# EAGLE design baby_monitor_v0 (EAGLE 9.6.2)

## Sheet 1 of 3: Power
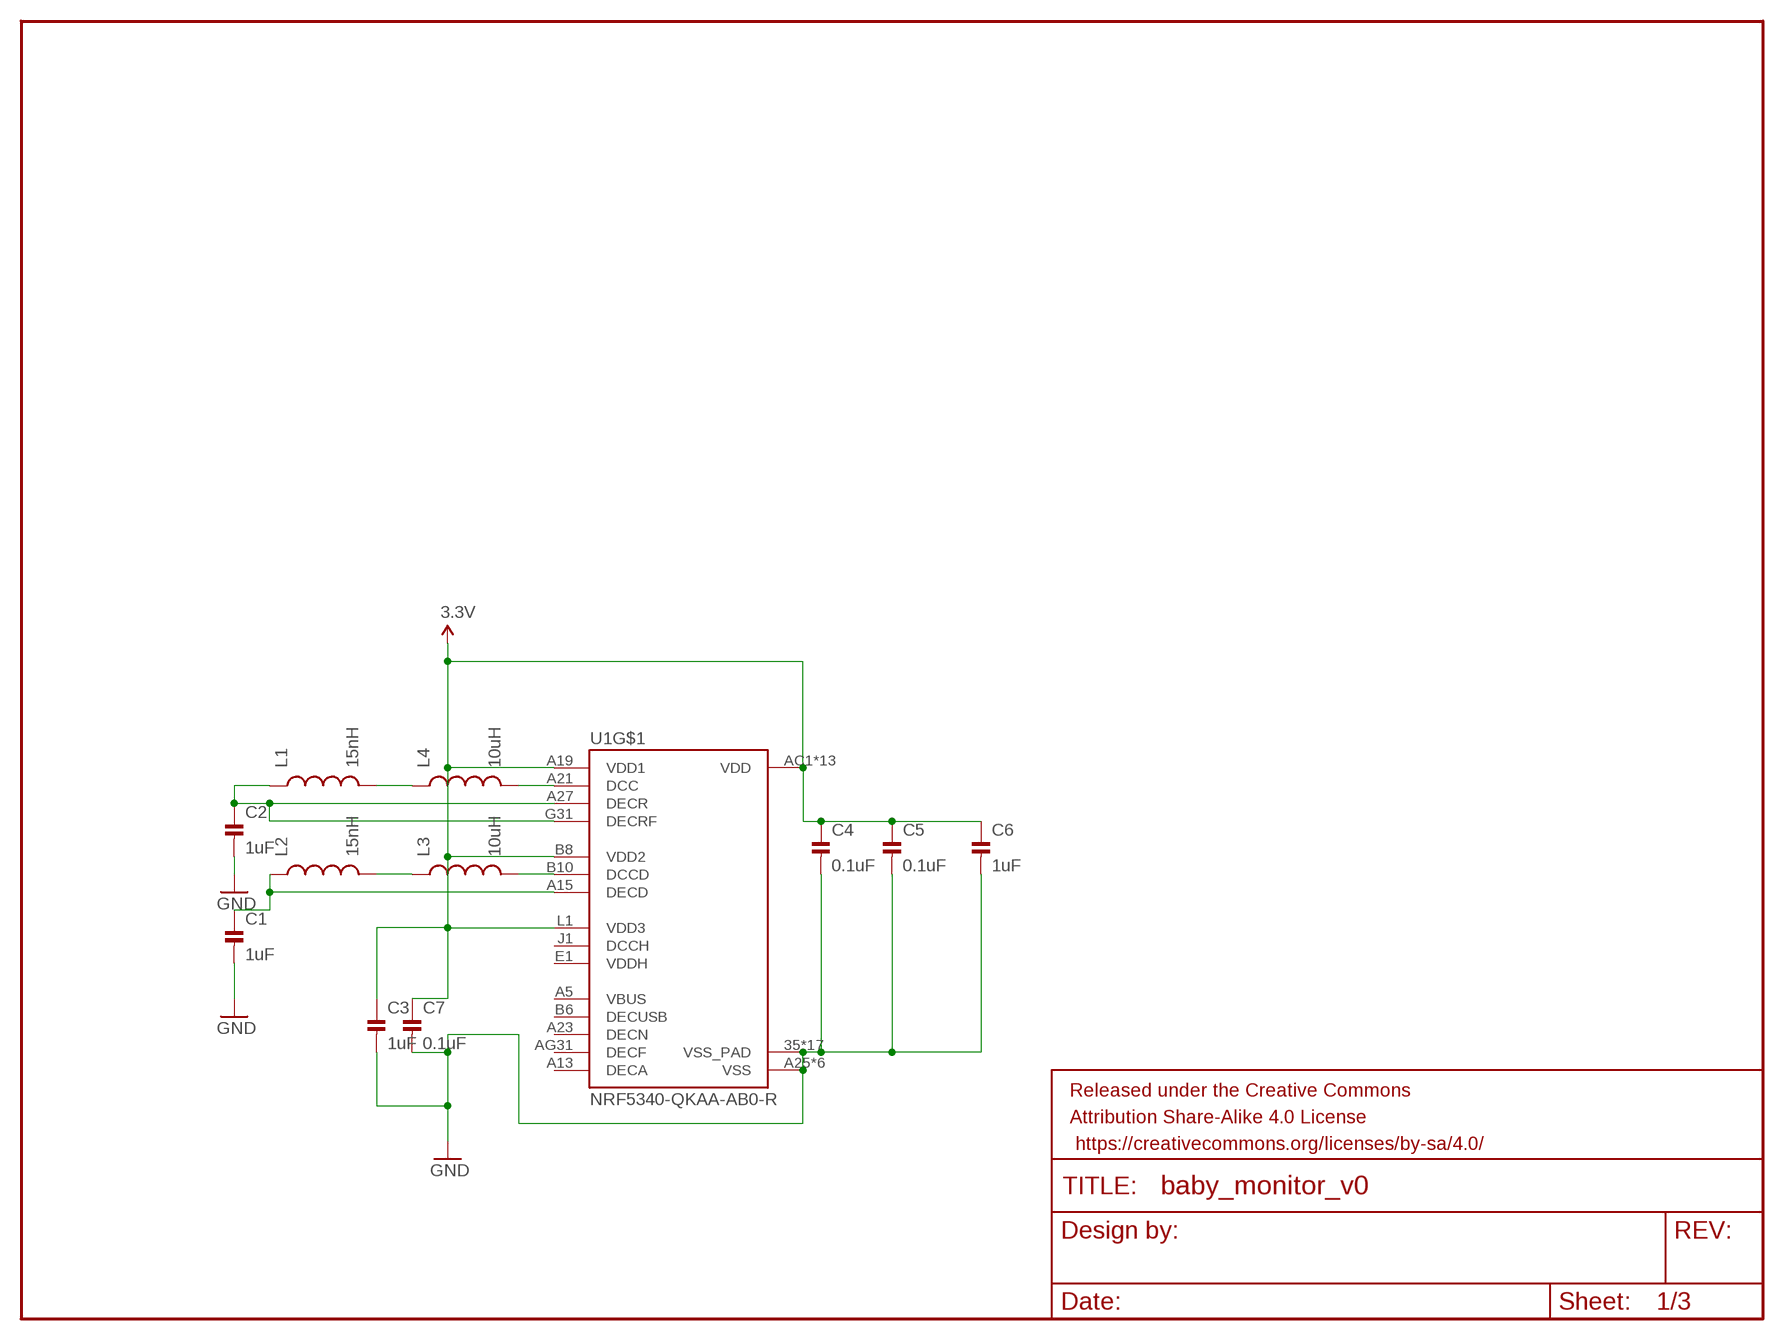
[diagram p0: schematic, sheet 1]

### Parts
C1  1uF  MICROBUILDER_CAP_CERAMIC_0402MP  [MICROBUILDER__0402MP]
C2  1uF  MICROBUILDER_CAP_CERAMIC_0402MP  [MICROBUILDER__0402MP]
C3  1uF  MICROBUILDER_CAP_CERAMIC_0402MP  [MICROBUILDER__0402MP]
C4  0.1uF  MICROBUILDER_CAP_CERAMIC_0402MP  [MICROBUILDER__0402MP]
C5  0.1uF  MICROBUILDER_CAP_CERAMIC_0402MP  [MICROBUILDER__0402MP]
C6  1uF  MICROBUILDER_CAP_CERAMIC_0402MP  [MICROBUILDER__0402MP]
C7  0.1uF  MICROBUILDER_CAP_CERAMIC_0402MP  [MICROBUILDER__0402MP]
FRAME1  FRAME-LETTERNO_PACKAGE  [DUMMY]
L1  15nH  NORDIC_MISC_INDUCTOR_0402_N  [NORDIC_MISC_RESC0402_N]
L2  15nH  NORDIC_MISC_INDUCTOR_0402_N  [NORDIC_MISC_RESC0402_N]
L3  10uH  NORDIC_MISC_INDUCTOR_0603_N  [NORDIC_MISC_RESC0603_N]
L4  10uH  NORDIC_MISC_INDUCTOR_0603_N  [NORDIC_MISC_RESC0603_N]
U1  NRF5340-QKAA-AB0-R  [XCVR_NRF5340-QKAA-AB0-R]

### Nets
3.3V: C3.1 C4.1 C5.1 C6.1 C7.1 U1.A19(VDD1) U1.AC1(VDD) U1.AG1(VDD) U1.AJ31(VDD) U1.AL3(VDD) U1.AL7(VDD) U1.AL11(VDD) U1.AL17(VDD) U1.AL25(VDD) U1.B8(VDD2) U1.B28(VDD) U1.C1(VDD) U1.E31(VDD) U1.L1(VDD3) U1.N31(VDD) U1.U1(VDD) ; also sheet 2,3
GND: C1.2 C2.2 C3.2 C4.2 C5.2 C6.2 C7.2 U1.35(VSS_PAD) U1.36(VSS_PAD) U1.37(VSS_PAD) U1.38(VSS_PAD) U1.39(VSS_PAD) U1.40(VSS_PAD) U1.41(VSS_PAD) U1.43(VSS_PAD) U1.44(VSS_PAD) U1.45(VSS_PAD) U1.46(VSS_PAD) U1.47(VSS_PAD) U1.48(VSS_PAD) U1.49(VSS_PAD) U1.50(VSS_PAD) U1.51(VSS_PAD) U1.104(VSS_PAD) U1.A25(VSS) U1.B12(VSS) U1.B26(VSS) U1.G1(VSS) U1.H2(VSS) U1.J31(VSS) ; also sheet 2,3
N$4: L4.2 U1.A21(DCC)
N$5: L1.2 L4.1
N$6: L2.2 L3.1
N$7: L3.2 U1.B10(DCCD)
N$8: C2.1 L1.1 U1.A27(DECR) U1.G31(DECRF)
N$9: C1.1 L2.1 U1.A15(DECD)

## Sheet 2 of 3: Antenna
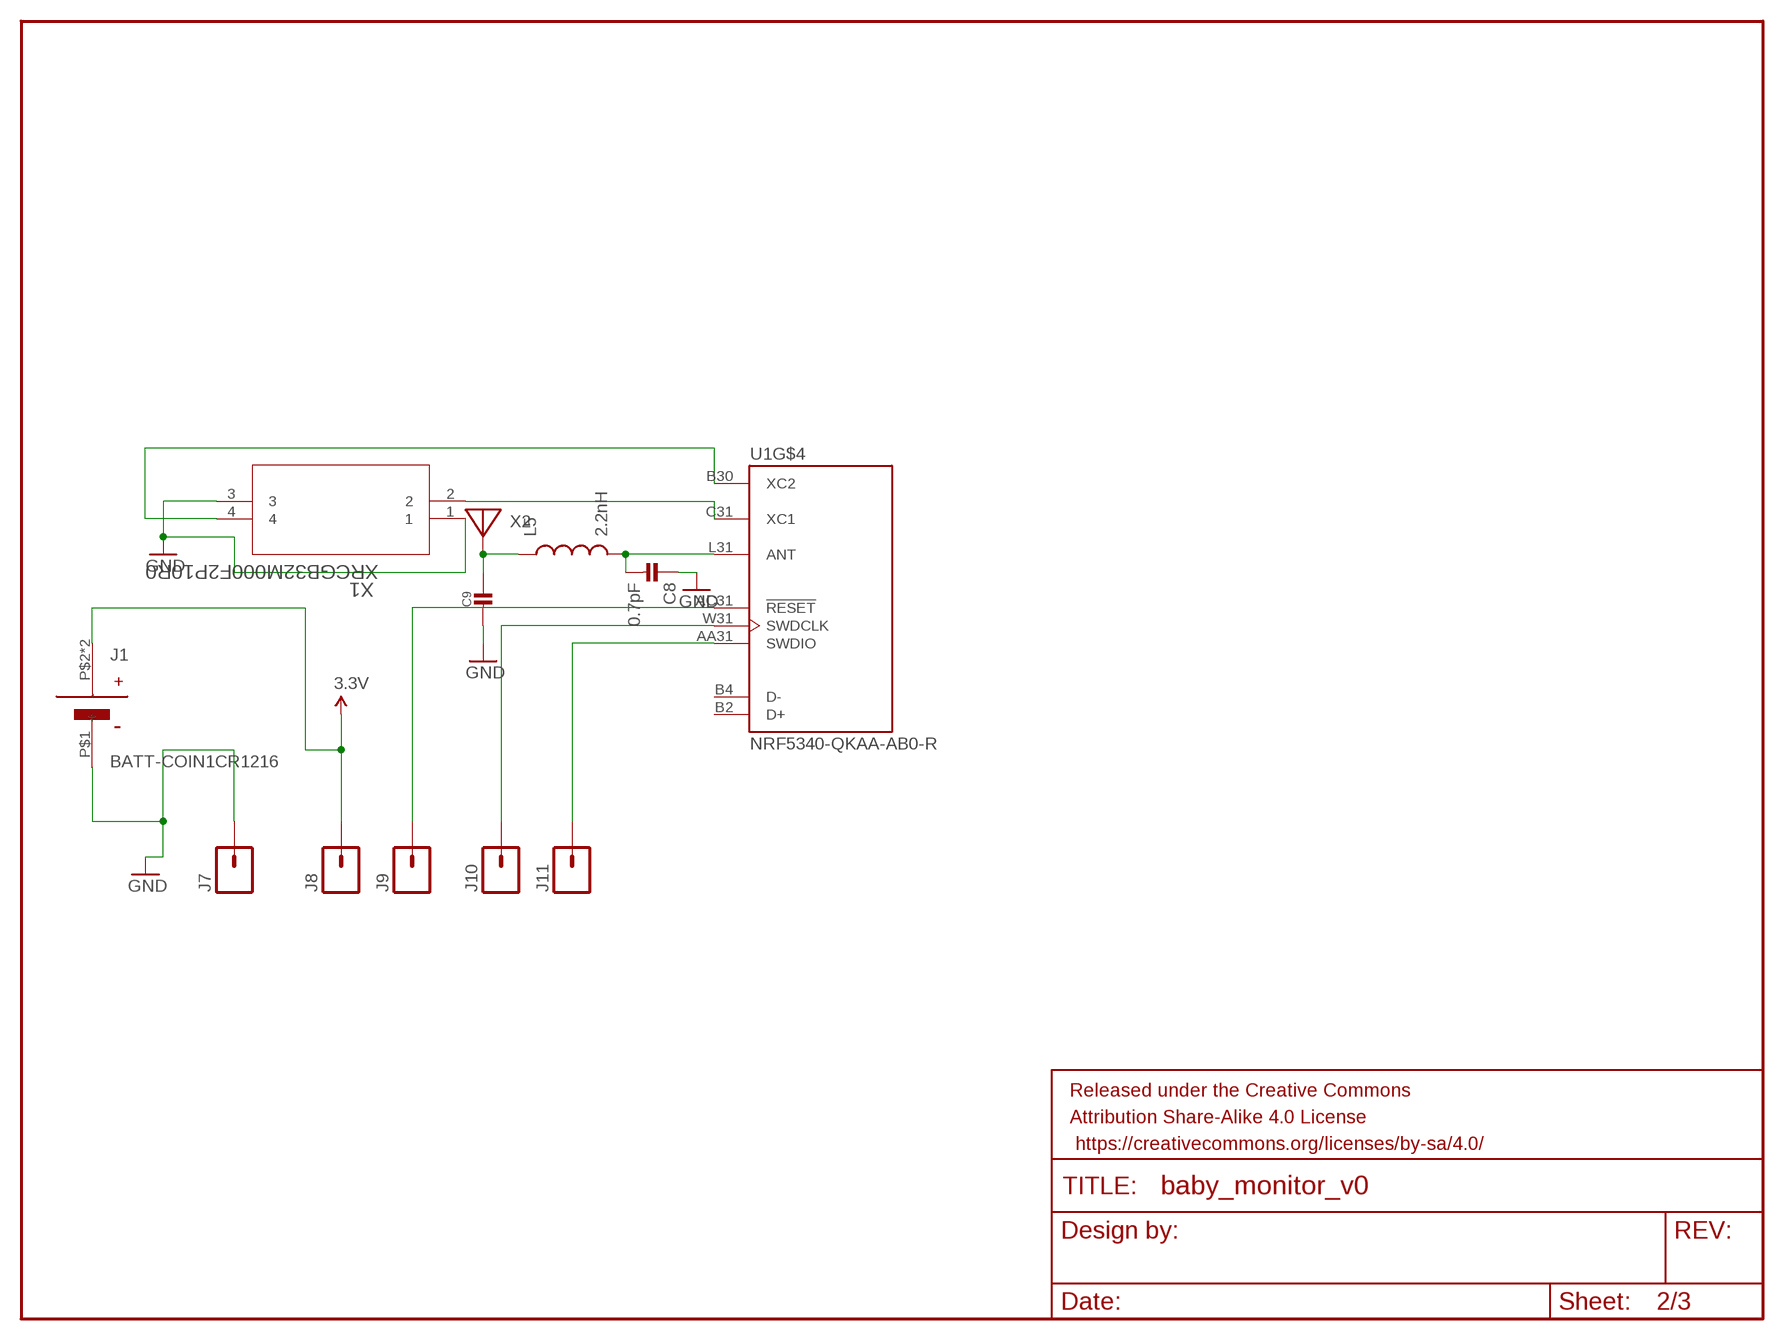
[diagram p1: schematic, sheet 2]

### Parts
C8  0.7pF  MICROBUILDER_CAP_CERAMIC_0402MP  [MICROBUILDER__0402MP]
C9  MICROBUILDER_CAP_CERAMIC_0402MP  [MICROBUILDER__0402MP]
FRAME3  FRAME-LETTERNO_PACKAGE  [DUMMY]
J1  BATT-COIN1CR1216  [BC-2017-TR]
J7  M01TINY  [1X01_TINY]
J8  M01TINY  [1X01_TINY]
J9  M01TINY  [1X01_TINY]
J10  M01TINY  [1X01_TINY]
J11  M01TINY  [1X01_TINY]
L5  2.2nH  NORDIC_MISC_INDUCTOR_0402_N  [NORDIC_MISC_RESC0402_N]
X1  XRCGB32M000F2P10R0  [XTAL_SON4_1P6X2P0_MUR]
X2  ADAFRUIT_WIRELESS_ANTENNA_JOHANSON_2450AT18B100  [ADAFRUIT_WIRELESS_ANT_2450AT18B100]

### Nets
3.3V: J1.P$2(+) J1.P$3(+) J8.P$1 ; also sheet 1,3
GND: C8.1 C9.2 J1.P$1(-) J7.P$1 X1.1 X1.3 ; also sheet 1,3
N$10: U1.C31(XC1) X1.2
N$11: U1.B30(XC2) X1.4
N$12: C8.2 L5.2 U1.L31(ANT)
N$13: C9.1 L5.1 X2.FP
RESET: J9.P$1 U1.AC31(!RESET)
SWCLK: J10.P$1 U1.W31(SWDCLK)
SWDIO: J11.P$1 U1.AA31(SWDIO)
Unconnected: U1.B2(D+) U1.B4(D-)

## Sheet 3 of 3: Peripheral
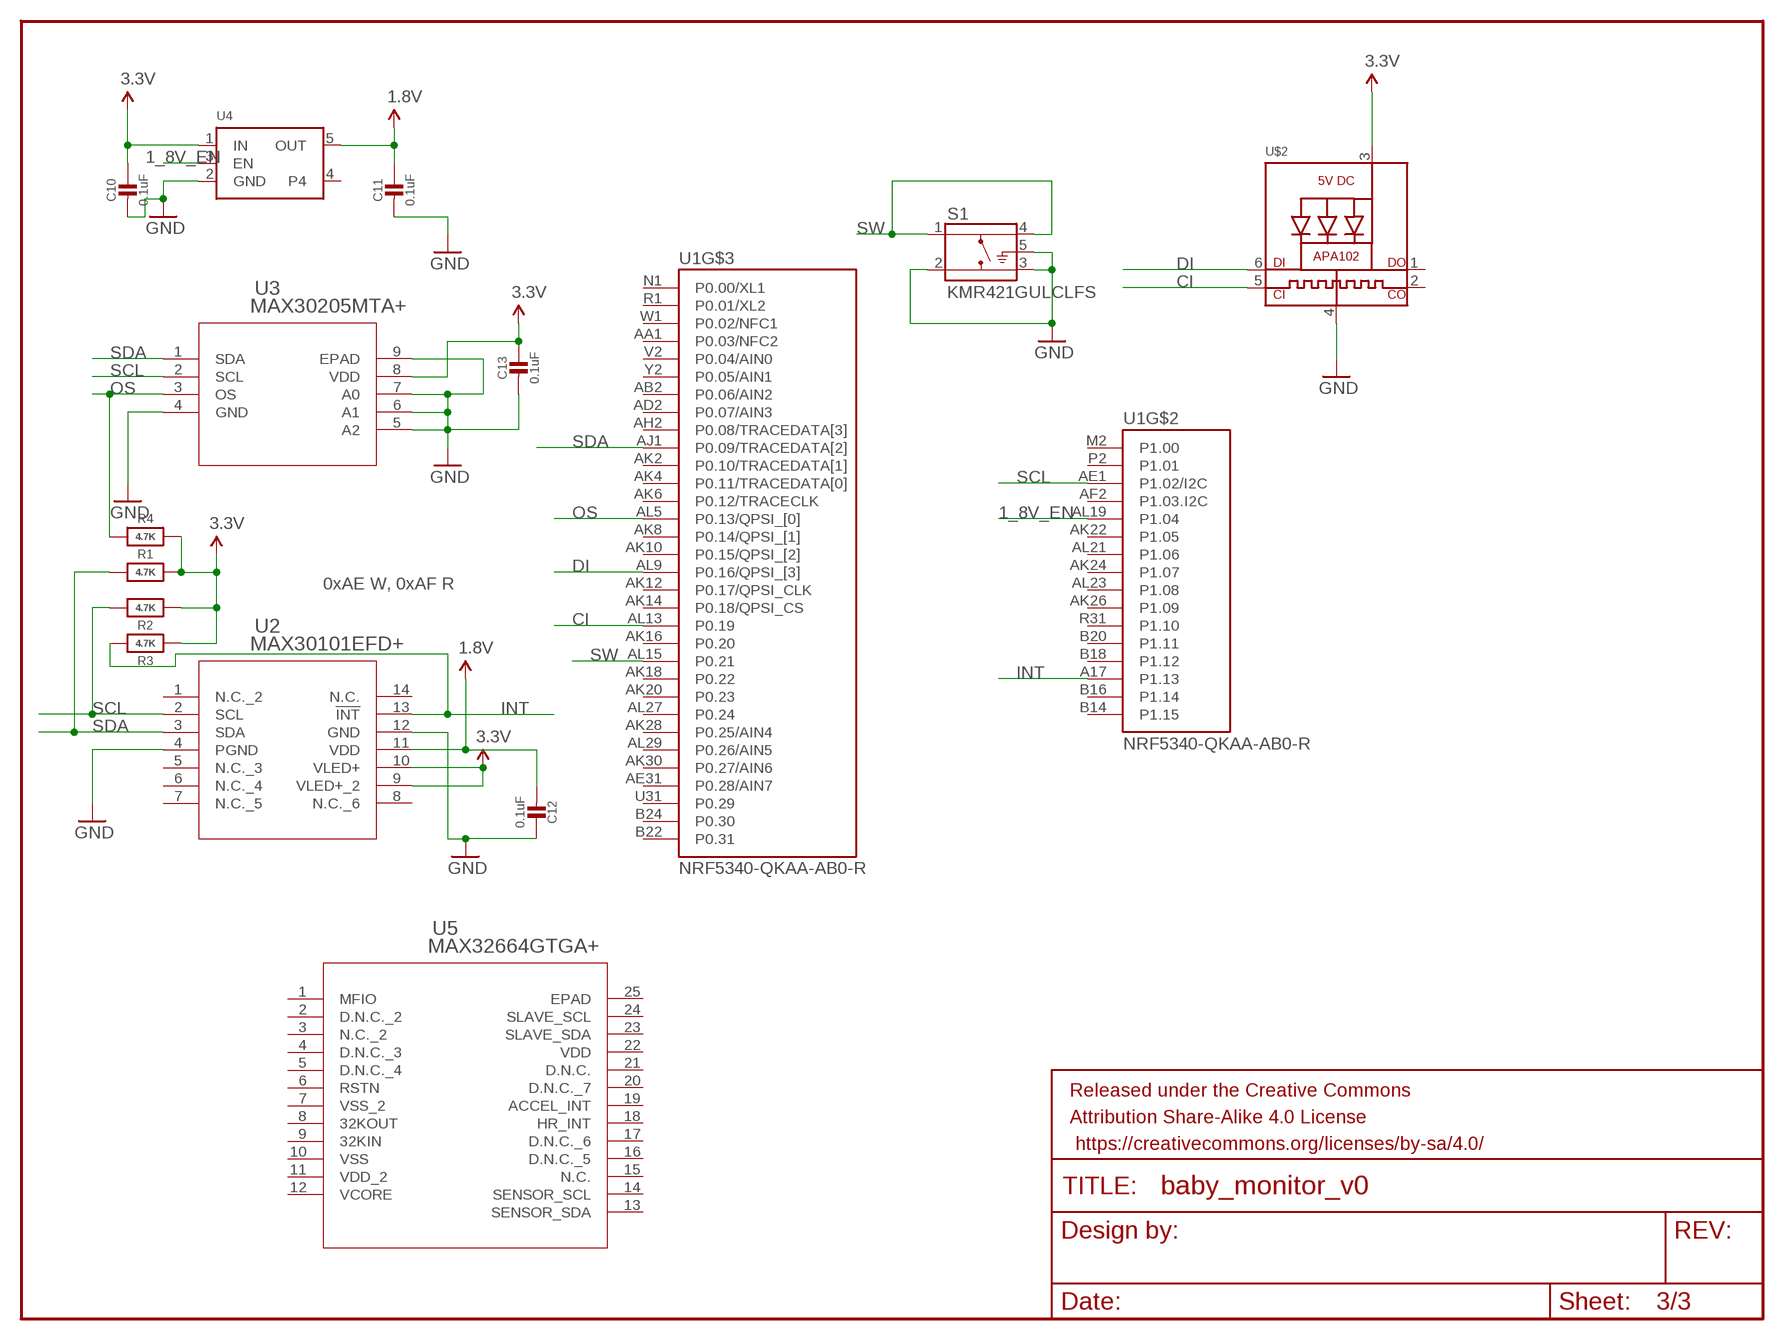
[diagram p2: schematic, sheet 3]

### Parts
C10  0.1uF  MICROBUILDER_CAP_CERAMIC_0402MP  [MICROBUILDER__0402MP]
C11  0.1uF  MICROBUILDER_CAP_CERAMIC_0402MP  [MICROBUILDER__0402MP]
C12  0.1uF  MICROBUILDER_CAP_CERAMIC_0402MP  [MICROBUILDER__0402MP]
C13  0.1uF  MICROBUILDER_CAP_CERAMIC_0402MP  [MICROBUILDER__0402MP]
FRAME2  FRAME-LETTERNO_PACKAGE  [DUMMY]
R1  4.7K  MICROBUILDER_RESISTOR_0402MP  [MICROBUILDER__0402MP]
R2  4.7K  MICROBUILDER_RESISTOR_0402MP  [MICROBUILDER__0402MP]
R3  4.7K  MICROBUILDER_RESISTOR_0402MP  [MICROBUILDER__0402MP]
R4  4.7K  MICROBUILDER_RESISTOR_0402MP  [MICROBUILDER__0402MP]
S1  KMR421GULCLFS  [SW_KMR421GULCLFS]
U2  MAX30101EFD+  [21-0880B_MXM]
U3  MAX30205MTA+  [21-0137_T833+2_MXM]
U4  MICROBUILDER_VREG_SOT23-5  [MICROBUILDER_SOT23-5]
U5  MAX32664GTGA+  [21-100264_90-100089_MXM]
U$2  MICROBUILDER_APA1022020  [MICROBUILDER_APA102_2020]

### Nets
1.8V: C11.1 C12.2 U2.11(VDD) U4.5(OUT)
1_8V_EN: U1.AL19(P1.04) U4.3(EN)
3.3V: C10.1 C13.1 R1.2 R2.1 R3.1 R4.2 U2.9(VLED+_2) U2.10(VLED+) U3.8(VDD) U4.1(IN) U$2.3(VDD) ; also sheet 1,2
CI: U1.AL13(P0.19) U$2.5(CKI)
DI: U1.AL9(P0.16/QPSI_[3]) U$2.6(DI)
GND: C10.2 C11.2 C12.1 C13.2 S1.2 S1.3 S1.5(G) U2.4(PGND) U2.12(GND) U3.4(GND) U3.5(A2) U3.6(A1) U3.7(A0) U3.9(EPAD) U4.2(GND) U$2.4(GND) ; also sheet 1,2
INT: R3.2 U1.A17(P1.13) U2.13(!INT)
OS: R4.1 U1.AL5(P0.13/QPSI_[0]) U3.3(OS)
SCL: R2.2 U1.AE1(P1.02/I2C) U2.2(SCL) U3.2(SCL)
SDA: R1.1 U1.AJ1(P0.09/TRACEDATA[2]) U2.3(SDA) U3.1(SDA)
SW: S1.1 S1.4 U1.AL15(P0.21)
Unconnected: U1.AA1(P0.03/NFC2) U1.AB2(P0.06/AIN2) U1.AD2(P0.07/AIN3) U1.AE31(P0.28/AIN7) U1.AF2(P1.03.I2C) U1.AH2(P0.08/TRACEDATA[3]) U1.AK2(P0.10/TRACEDATA[1]) U1.AK4(P0.11/TRACEDATA[0]) U1.AK6(P0.12/TRACECLK) U1.AK8(P0.14/QPSI_[1]) U1.AK10(P0.15/QPSI_[2]) U1.AK12(P0.17/QPSI_CLK) U1.AK14(P0.18/QPSI_CS) U1.AK16(P0.20) U1.AK18(P0.22) U1.AK20(P0.23) U1.AK22(P1.05) U1.AK24(P1.07) U1.AK26(P1.09) U1.AK28(P0.25/AIN4) U1.AK30(P0.27/AIN6) U1.AL21(P1.06) U1.AL23(P1.08) U1.AL27(P0.24) U1.AL29(P0.26/AIN5) U1.B14(P1.15) U1.B16(P1.14) U1.B18(P1.12) U1.B20(P1.11) U1.B22(P0.31) U1.B24(P0.30) U1.M2(P1.00) U1.N1(P0.00/XL1) U1.P2(P1.01) U1.R1(P0.01/XL2) U1.R31(P1.10) U1.U31(P0.29) U1.V2(P0.04/AIN0) U1.W1(P0.02/NFC1) U1.Y2(P0.05/AIN1) U2.1(N.C._2) U2.5(N.C._3) U2.6(N.C._4) U2.7(N.C._5) U2.8(N.C._6) U2.14(N.C.) U4.4 U5.1(MFIO) U5.2(D.N.C._2) U5.3(N.C._2) U5.4(D.N.C._3) U5.5(D.N.C._4) U5.6(RSTN) U5.8(32KOUT) U5.9(32KIN) U5.13(SENSOR_SDA) U5.14(SENSOR_SCL) U5.15(N.C.) U5.16(D.N.C._5) U5.17(D.N.C._6) U5.18(HR_INT) U5.19(ACCEL_INT) U5.20(D.N.C._7) U5.21(D.N.C.) U5.23(SLAVE_SDA) U5.24(SLAVE_SCL) U$2.1(DO) U$2.2(CKO)

### Notes on the sheet
- 0xAE W, 0xAF R

## Power pins joined to a net without a drawn wire
DCCH: U1.J1(DCCH)
DECA: U1.A13(DECA)
DECF: U1.AG31(DECF)
DECN: U1.A23(DECN)
DECUSB: U1.B6(DECUSB)
EPAD: U5.25(EPAD)
VBUS: U1.A5(VBUS)
VCORE: U5.12(VCORE)
VDD: U5.22(VDD)
VDD_2: U5.11(VDD_2)
VDDH: U1.E1(VDDH)
VSS: U5.10(VSS)
VSS_2: U5.7(VSS_2)

## Library data of the parts
C1-C8 C10-C13 = Adafruit Circuit Playground Bluefruit:MICROBUILDER_CAP_CERAMIC: Ceramic Capacitors For new designs, use the packages preceded by an '_' character since they are more reliable: The following footprints should be used on most boards: _0402 - Standard footprint for regular board layouts _0603 - Standard footprint for regular board layouts _0805 - Standard footprint for regular board layouts _1206 - Standard footprint for regular board layouts For extremely tight-pitch boards where space is at a premium, the following 'micro-pitch' footprints can be used (smaller pads, no silkscreen outline, etc.): _0402MP - Micro-pitch footprint for very dense/compact boards _0603MP - Micro-pitch footprint for very dense/compact boards _0805MP - Micro-pitch footprint for very dense/compact boards _1206MP - Micro-pitch footprint for very dense/compact boards
C9 = graftel-internal-ic:MICROBUILDER_CAP_CERAMIC: Ceramic Capacitors For new designs, use the packages preceded by an '_' character since they are more reliable: The following footprints should be used on most boards: _0402 - Standard footprint for regular board layouts _0603 - Standard footprint for regular board layouts _0805 - Standard footprint for regular board layouts _1206 - Standard footprint for regular board layouts For extremely tight-pitch boards where space is at a premium, the following 'micro-pitch' footprints can be used (smaller pads, no silkscreen outline, etc.): _0402MP - Micro-pitch footprint for very dense/compact boards _0603MP - Micro-pitch footprint for very dense/compact boards _0805MP - Micro-pitch footprint for very dense/compact boards _1206MP - Micro-pitch footprint for very dense/compact boards
FRAME1-FRAME3 = SparkFun-Aesthetics:FRAME-LETTER: Schematic Frame Standard 8.5x11 US Letter frame; DESIGNER: Nobody; VERSION: v01
J1 = graftel-internal-ic:BATT-COIN1: Digikey Part Number: BLP2032SM-GCT-ND link:https://www.digikey.com/product-detail/en/mpd-memory-protection-devices/BLP2032SM-GTR/BLP2032SM-GCT-ND/3628537
J7-J11 = graftel-internal-ic:M01: Header 1 Standard 1-pin 0.1" header. Use with straight break away headers (SKU : PRT-00116), right angle break away headers (PRT-00553), swiss pins (PRT-00743), machine pins (PRT-00117), and female headers (PRT-00115). SMTSO-256-ET is a "flush mount" nut for a 4-40 screw. The older package used to be too tight, and did not allow it to sit properly thru the drill hit. The latest (0.165DIA) fits nice and snug.
L1-L5 = Adafruit Circuit Playground Bluefruit:NORDIC_MISC_INDUCTOR: Generic chip inductor
R1-R4 = Adafruit Circuit Playground Bluefruit:MICROBUILDER_RESISTOR: Resistors For new designs, use the packages preceded by an '_' character since they are more reliable: The following footprints should be used on most boards: _0402 - Standard footprint for regular board layouts _0603 - Standard footprint for regular board layouts _0805 - Standard footprint for regular board layouts _1206 - Standard footprint for regular board layouts For extremely tight-pitch boards where space is at a premium, the following 'micro-pitch' footprints can be used (smaller pads, no silkscreen outline, etc.): _0402MP - Micro-pitch footprint for very dense/compact boards _0603MP - Micro-pitch footprint for very dense/compact boards _0805MP - Micro-pitch footprint for very dense/compact boards _1206MP - Micro-pitch footprint for very dense/compact boards
S1 = graftel-internal-ic:KMR421GULCLFS: Switch Tactile N.O. SPST Round Button Gull Wing 0.05A 32VDC 1VA 200000Cycles 2N SMD Automotive T/R; DESCRIPTION: Tactile Switch SPST-NO Top Actuated Surface Mount; DIGI-KEY_PART_NUMBER: CKN12152CT-ND; MF: C&K; MP: KMR421GULCLFS; PACKAGE: None; PURCHASE-URL: https://pricing.snapeda.com/search/part/KMR421GULCLFS/?ref=eda
U1 = graftel-internal-ic:NRF5340-QKAA-AB0-R: IC RF; AVAILABILITY: Unavailable; DESCRIPTION: IC RF TxRx + MCU 802.15.4, Bluetooth Bluetooth v5.1, Thread, Zigbee® 2.4GHz; MF: Nordic Semiconductor; MP: nRF5340-QKAA-AB0-R; PACKAGE: None; PRICE: None
U2 = graftel-internal-ic:MAX30101EFD+; BUILT_BY: EMA_UL_Team; MANUFACTURER_PART_NUMBER: MAX30101EFD+; SOURCELIBRARY: Update_to_database_2021-01-13; VENDOR: Maxim Integrated Products
U3 = graftel-internal-ic:MAX30205MTA+; BUILT_BY: EMA_UL_Team; COPYRIGHT: Copyright (C) 2018 Accelerated Designs. All rights reserved; MANUFACTURER_PART_NUMBER: MAX30205MTA+; REVISION: 4; SOURCELIBRARY: Update_to_database_2020-12-07; VENDOR: Maxim Integrated Products
U4 = Adafruit Circuit Playground Bluefruit:MICROBUILDER_VREG_SOT23-5: SOT23-5 Fixed Voltage Regulators Part Current Out V Out V In V Dropout θJA (°C/W) TJ (°C) Digikey Part No. ADP121 150mA 3.3V 3.4-5.5V 0.09V @ 150mA -- -- ADP121-AUJZ33R7CT-ND ADP121 150mA 3.0V 3.1-5.5V 0.09V @ 150mA -- -- ADP121-AUJZ30R7CT-ND ADP122 300mA 3.3V 3.4-5.5V 0.085V @ 300mA -- -- ADP122AUJZ-3.3-R7CT-ND ADP1712 300mA 3.3V 3.5-5.5V 0.17V @ 300mA -- -- ADP1712AUJZ-3.3-R7TR-ND AP7311 (Low Cost) 150mA 3.3V 3.5-6V 0.15V @ 150mA -- -- AP7311-33WG-7DICT-ND LD39015M18R 150mA 1.8V 1.9V-5.5V 0.08V @ 100mA -- -- 497-6977-1-ND LP2985A-33DBVR 150mA 3.3V 3.3-16V 0.28V @ 150mA 206 150 296-18479-1-ND MCP1824T-3302E/OT 300mA 3.3V 3.5V-6V 0.2V @ 300mA -- -- MCP1824T-3302E/OTCT-ND MIC5205-2.5YM5 TR 150mA 2.5V 2.7-16V 0.165V @ 150mA -- -- 576-1257-2-ND MIC5205-3.0YM5 TR 150mA 3.0V 3.2V-16V 0.165V @ 150mA -- -- 576-1258-2-ND MIC5205-3.3YM5 TR 150mA 3.3V 3.5V-16V 0.165V @ 150mA -- -- 576-1259-2-ND TPS780330220 150mA 3.3V+2.2V 3.6-5.5V 250mV Max -- -- 296-23332-1-ND TDA3663/N1,135 100mA 3.3V 3.5-45V 0.18V @ 50mA -- -- 568-5343-1-ND Max operating temp can be calculated using θJA, TJ (max junction temperature), and power in watts. Set the "Maximum Ambient Temperature" until it reaches TJ ("Max Junction Temperature"), which is the absolute limit for safe use of the regulator: Heat Sink Temperature Calculator <http://www.daycounter.com/Calculators/Heat-Sink-Temperature-Calculator.phtml> For example, With 12V source into a 3.3V LP2985 and a 30mA load, we are dissipating (12V-3.3V) * 0.03A = 0.261W. With a θJA of 206 °C/W, a TJ of 150°C, and 261mW we can safely use the chip without a heat sink up to 75°C (=147.1°C Junction Temperature).
U5 = graftel-internal-ic:MAX32664GTGA+; BUILT_BY: EMA_Rebekah; COPYRIGHT: Copyright (C) 2018 Accelerated Designs. All rights reserved; MANUFACTURER_PART_NUMBER: MAX32664GTGA+; REVISION: 2; SOURCELIBRARY: Maxim_2020-02-10; VENDOR: Maxim Integrated Products
U$2 = graftel-internal-ic:MICROBUILDER_APA102: APA102/DotStar Pixels VCC: 5V DC Refresh Rate: 400Hz
X1 = graftel-internal-ic:XRCGB32M000F2P10R0; BUILT_BY: EMA_UL_Team; DIGIKEY_PART: 490-14308-1-ND; MANUFACTURER_PART_NUMBER: XRCGB32M000F2P10R0; SOURCELIBRARY: Murata_2017-08-09; VENDOR: Murata
X2 = graftel-internal-ic:ADAFRUIT_WIRELESS_ANTENNA_JOHANSON_2450AT18B100: Johanson 2.4GHz Chip Antenna (1206 Package) Frequency Range: 2400 - 2500 Mhz Peak Gain 0.5 dBi typ. (XZ-V) Average Gain -0.5 dBi typ. (XZ-V) Input Power 3W max. Operating Temperature -40 to +85°C Digikey: 712-1006-1-ND; DIGIKEY_PART: 712-1006-1-ND

## Board
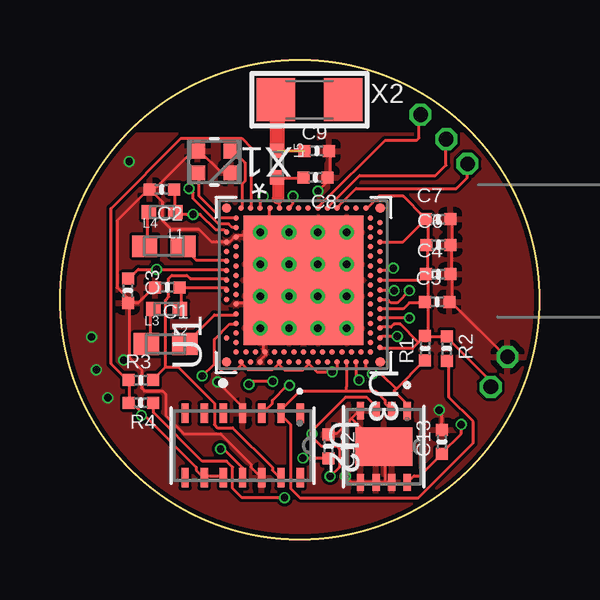
[diagram p3: board, top side]
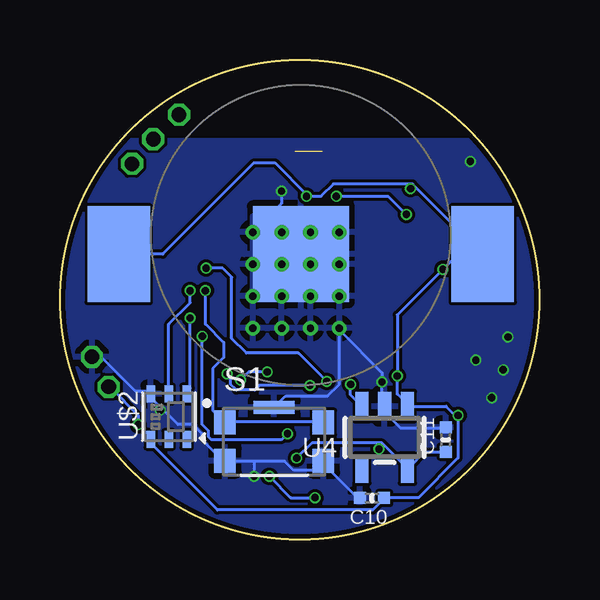
[diagram p4: board, bottom side, seen from below]

Size 20 x 20 mm. Coordinates in mm from the lower left corner, seen from the top.
Outline: circle at 10,10 radius 10
Copper layers (1*16): Top 0.035559375mm / dielectric 1.6mm / Bottom 0.035559375mm
Design rules "jlcpcb2layer": minimum track width 5mil, minimum drill 12mil, track to track 5mil, track to pad 5mil, pad to pad 5mil, via to via 5mil, smd to smd 5mil, copper to edge 8mil, drill to drill 6mil, minimum pad ring 5mil, minimum via ring 3mil, stop-mask expansion 2.5mil, vias tented up to drill 0mil, thermal gap 10mil

### Footprints (pad centres in the part's own frame; a part is rotated, then mirrored left to right if it is on the bottom)
MICROBUILDER__0402MP = smd 0.5 x 0.5: 1 -0.508,0; 2 0.508,0
BC-2017-TR = smd 4 x 4: P$1 0,0 | smd 2.6 x 4: P$2 -7.59,0; P$3 7.59,0
1X01_TINY = drill 0.61 octagon: P$1 0,0
NORDIC_MISC_RESC0402_N = smd 0.6 x 0.6: 1 -0.55,0; 2 0.55,0
NORDIC_MISC_RESC0603_N = smd 1.05 x 0.9: 1 -0.8,0; 2 0.8,0
SW_KMR421GULCLFS = smd 0.9 x 1: 1 -2.05,0.8; 2 -2.05,-0.8; 3 2.05,-0.8; 4 2.05,0.8 | smd 1.7 x 0.55: 5 0,1.425
XCVR_NRF5340-QKAA-AB0-R = drill 0.305 pad 0.61: 35 -1.8,-1.8; 36 -0.467,-1.8; 37 0.867,-1.8; 38 2.2,-1.8; 39 -1.8,-0.6; 40 -0.467,-0.6; 41 0.867,-0.6; 43 2.2,-0.6; 44 -1.8,0.6; 45 -0.467,0.6; 46 0.867,0.6; 47 2.2,0.6; 48 -1.8,1.8; 49 -0.467,1.8; 50 0.867,1.8; 51 2.2,1.8 | smd 5.4 x 5: 104 0.2,0 | smd 0.4 x 0.4: A1 -3.2,3.2; A31 3.2,3.2; AL1 -3.2,-3.2; AL31 3.2,-3.2 | smd 0.225 x 0.225: A5 -2.2,3.2; A13 -0.6,3.2; A15 -0.2,3.2; A17 0.2,3.2; A19 0.6,3.2; A21 1,3.2; A23 1.4,3.2; A25 1.8,3.2; A27 2.2,3.2; AA1 -3.2,-1; AA31 3.2,-1; AB2 -2.8,-1.2; AC1 -3.2,-1.4; AC31 3.2,-1.4; AD2 -2.8,-1.6; AE1 -3.2,-1.8; AE31 3.2,-1.8; AF2 -2.8,-2; AG1 -3.2,-2.2; AG31 3.2,-2.2; AH2 -2.8,-2.4; AJ1 -3.2,-2.6; AJ31 3.2,-2.6; AK2 -2.8,-2.8; AK4 -2.4,-2.8; AK6 -2,-2.8; AK8 -1.6,-2.8; AK10 -1.2,-2.8; AK12 -0.8,-2.8; AK14 -0.4,-2.8; AK16 0,-2.8; AK18 0.4,-2.8; AK20 0.8,-2.8; AK22 1.2,-2.8; AK24 1.6,-2.8; AK26 2,-2.8; AK28 2.4,-2.8; AK30 2.8,-2.8; AL3 -2.6,-3.2; AL5 -2.2,-3.2; AL7 -1.8,-3.2; AL9 -1.4,-3.2; AL11 -1,-3.2; AL13 -0.6,-3.2; AL15 -0.2,-3.2; AL17 0.2,-3.2; AL19 0.6,-3.2; AL21 1,-3.2; AL23 1.4,-3.2; AL25 1.8,-3.2; AL27 2.2,-3.2; AL29 2.6,-3.2; B2 -2.8,2.8; B4 -2.4,2.8; B6 -2,2.8; B8 -1.6,2.8; B10 -1.2,2.8; B12 -0.8,2.8; B14 -0.4,2.8; B16 0,2.8; B18 0.4,2.8; B20 0.8,2.8; B22 1.2,2.8; B24 1.6,2.8; B26 2,2.8; B28 2.4,2.8; B30 2.8,2.8; C1 -3.2,2.6; C31 3.2,2.6; D2 -2.8,2.4; E1 -3.2,2.2; E31 3.2,2.2; F2 -2.8,2; G1 -3.2,1.8; G31 3.2,1.8; H2 -2.8,1.6; J1 -3.2,1.4; J31 3.2,1.4; K2 -2.8,1.2; L1 -3.2,1; L31 3.2,1; M2 -2.8,0.8; N1 -3.2,0.6; N31 3.2,0.6; P2 -2.8,0.4; R1 -3.2,0.2; R31 3.2,0.2; T2 -2.8,0; U1 -3.2,-0.2; U31 3.2,-0.2; V2 -2.8,-0.4; W1 -3.2,-0.6; W31 3.2,-0.6; Y2 -2.8,-0.8
21-0880B_MXM = smd 0.813 x 0.305: 1 -1.346,2.4; 2 -1.346,1.6; 3 -1.346,0.8; 4 -1.346,0; 5 -1.346,-0.8; 6 -1.346,-1.6; 7 -1.346,-2.4; 8 1.346,-2.4; 9 1.346,-1.6; 10 1.346,-0.8; 11 1.346,0; 12 1.346,0.8; 13 1.346,1.6; 14 1.346,2.4
21-0137_T833+2_MXM = smd 0.711 x 0.305: 1 -1.499,0.975; 2 -1.499,0.325; 3 -1.499,-0.325; 4 -1.499,-0.975; 5 1.499,-0.975; 6 1.499,-0.325; 7 1.499,0.325; 8 1.499,0.975 | smd 1.6 x 2.388: 9 0,0
MICROBUILDER_SOT23-5 = smd 0.55 x 1.2: 1 -0.95,-1.3; 2 0,-1.3; 3 0.95,-1.3; 4 0.95,1.3; 5 -0.95,1.3
21-100264_90-100089_MXM = smd 0.711 x 0.203: 1 -1.45,1.2; 2 -1.45,0.8; 3 -1.45,0.4; 4 -1.45,0; 5 -1.45,-0.4; 6 -1.45,-0.8; 13 1.45,-1.2; 14 1.45,-0.8; 15 1.45,-0.4; 16 1.45,0; 17 1.45,0.4; 18 1.45,0.8 | smd 0.203 x 0.711: 7 -1.2,-1.45; 8 -0.8,-1.45; 9 -0.4,-1.45; 10 0,-1.45; 11 0.4,-1.45; 12 0.8,-1.45; 19 1.2,1.45; 20 0.8,1.45; 21 0.4,1.45; 22 0,1.45; 23 -0.4,1.45; 24 -0.8,1.45 | smd 1.702 x 1.702: 25 0,0
MICROBUILDER_APA102_2020 = smd 0.7 x 0.35: 1 -0.95,-0.75; 2 -0.95,0; 3 -0.95,0.75; 4 0.95,0.75; 5 0.95,0; 6 0.95,-0.75
XTAL_SON4_1P6X2P0_MUR = smd 0.61 x 0.61: 1 -0.699,0.45; 2 -0.699,-0.45; 3 0.699,-0.45; 4 0.699,0.45
ADAFRUIT_WIRELESS_ANT_2450AT18B100 = smd 1.6 x 1.8: FP -1.4,0; NC 1.4,0

### Placement (x,y rotation side)
C1  4.48,10.52 180 top
C2  4.24,14.6 180 top
C3  2.84,10.38 270 top
C4  15.77,11.06 0 top
C5  15.73,9.92 0 top
C6  15.78,12.29 0 top
C7  15.76,13.36 0 top
C8  10.66,15.1 180 top
C9  10.71,16.2 0 top
C10  6.99,1.73 180 bottom
C11  3.91,4.17 90 bottom
C12  11.2,3.88 270 top
C13  15.93,4.07 90 top
FRAME1  4.16,-21.75 0 top  (outside the outline)
FRAME2  3.14,-22.77 0 top  (outside the outline)
FRAME3  2.13,-23.78 0 top  (outside the outline)
J1  9.96,11.9 0 bottom
J7  18.67,7.62 0 top
J8  17.97,6.37 0 top
J9  17,15.67 0 top
J10  15.03,17.72 0 top
J11  16.11,16.7 0 top
L1  4.26,13.66 180 top
L2  4.45,9.61 180 top
L3  4.41,8.16 0 top
L4  4.34,12.24 0 top
L5  9.05,15.65 270 top
R1  15.22,7.98 90 top
R2  16.13,7.96 270 top
R3  3.37,6.65 0 top
R4  3.37,5.7 180 top
S1  11.07,4.08 0 bottom
U1  10.15,10.62 90 top
U2  7.62,3.92 270 top
U3  13.51,3.88 270 top
U4  6.46,4.26 180 bottom
U5  2.2,-26.68 0 top  (outside the outline)
U$2  15.46,5.12 90 bottom
X1  6.44,15.75 180 top
X2  10.41,18.34 0 top

### Tracks (layer width: path | path; a pad name or v marks a point on that pad's centre or on a via)
1.8V  (via drill 0.3)
  Top 0.127: v10.13,3.4 11.14,3.4 C12.2 | v6.7,3.78 6.83,3.78 7.59,3.02 7.59,2.63 U2.11
  Bottom 0.127: C11.1 4.03,3.65 4.79,3.65 5.43,3.02 U4.5 5.56,3.02 6.57,4.03 6.7,4.03 | v10.13,3.4 9.49,4.03 6.7,4.03 | 6.7,4.03 v6.7,3.78
1_8V_EN  (via drill 0.3)
  Top 0.127: v13.91,11.32 13.8,11.22 U1.AL19 | v7.88,6.47 8,6.59 v8.88,6.59
  Bottom 0.127: v8.88,6.59 10.06,7.78 12.23,7.78 12.84,8.39 12.84,10.94 13.22,11.32 v13.91,11.32 | v7.88,6.47 7.88,6.03 U4.3
3.3V  (via drill 0.3)
  Top 0.127: U2.10 6.7,2.63 6.06,2.63 U2.9 5.94,2.63 5.68,2.89 5.68,3.02 3.52,5.17 | U1.E31 7.97,16.35 7.59,16.73 5.05,16.73 2.13,13.81 2.13,7.33 2.76,6.7 R3.1 2.89,6.57 2.89,5.81 | 2.89,5.81 3.52,5.17 | 2.89,5.81 R4.2 | v16.73,4.79 16.73,4.41 15.93,3.61 C13.1 15.02,2.66 14.76,2.66 U3.8 | U1.AJ31 12.79,13.81 13.3,14.32 14.32,14.32 15.21,13.43 C7.1 | C7.1 15.33,13.3 15.33,12.41 C6.1 15.33,12.29 15.33,11.14 C4.1 | 14.95,8.22 15.21,8.48 R1.2 | 14.95,8.22 14.7,7.97 13.43,7.97 U1.AL3 | 14.95,8.22 14.19,8.98 13.94,8.98 13.81,8.86 13.43,8.86 U1.AL7 | R1.2 15.33,8.48 16.1,8.48 R2.1 16.22,8.35 17.87,6.7 17.87,6.44 J8.P$1 | U1.AL11 13.43,9.62 14.32,9.62 14.57,9.87 15.21,9.87 C5.1 | C4.1 15.21,11.02 15.01,10.82 U1.AL17 | C5.1 15.33,10 15.33,11.02 C4.1 | R1.2 15.33,8.6 15.33,9.87 C5.1 | 7.59,7.33 7.84,7.08 8.86,7.08 9.11,7.33 | 6.44,7.33 6.44,8.35 7.08,8.98 7.33,8.98 U1.B8 | 6.44,7.33 6.83,6.95 7.21,6.95 7.59,7.33 | 7.59,7.33 U1.C1 | 10.38,7.33 10.13,7.08 9.37,7.08 9.11,7.33 | 10.38,7.33 U1.U1 | 9.11,7.33 U1.L1 | v5.94,6.83 6.44,7.33 | U1.A19 6.95,11.27 v4.03,11.27 3.27,11.27 2.89,10.89 C3.1 | v3.4,5.17 3.52,5.17 | U1.AG1 12.35,6.77 v12.47,6.65 | U1.B28 7.18,13.02 7.04,13.16 6.61,13.16 5.56,14.21 5.56,14.46 v5.38,14.64 | U1.N31 9.65,13.91 9.65,13.94 9.72,14.01 v9.72,14.31 | U1.AC1 11.55,7.19 v11.35,6.99 10.73,6.99 10.38,7.33 | U1.AL25 14.31,12.42 C7.1
  Bottom 0.127: J8.P$1 17.87,6.32 16.73,5.17 v16.73,4.79 16.22,4.29 U$2.3 16.1,4.16 16.1,3.9 13.43,1.24 6.95,1.24 6.57,1.62 C10.1 6.44,1.75 5.05,1.75 3.4,3.4 3.4,5.05 3.52,5.17 | 3.52,5.17 3.9,5.56 5.43,5.56 U4.1 5.56,5.68 5.94,6.06 v5.94,6.83 5.94,9.37 v4.03,11.27 2.89,12.41 | 2.89,12.41 2.38,11.91 J1.P$3 2.89,12.41 | 2.89,12.41 5.26,14.79 | 5.26,14.79 5.3,14.83 8.6,14.83 9.11,14.32 arc45 9.12,14.31 v9.72,14.31 9.72,14.39 11.04,15.71 11.91,15.71 15.71,11.91 17.49,11.91 J1.P$2 | 3.52,5.17 v3.4,5.17 | v5.38,14.64 5.26,14.75 5.26,14.79 | v11.35,6.99 12.13,6.99 v12.47,6.65
CI  (via drill 0.3)
  Top 0.127: v14.57,10.38 14.06,9.87 13.81,9.87 13.68,10 13.43,10 U1.AL13
  Bottom 0.127: v14.57,10.38 14.57,9.87 15.46,8.98 U$2.5
DI  (via drill 0.3)
  Top 0.127: v14.57,9.24 13.43,9.24 U1.AL9
  Bottom 0.127: v14.57,9.24 14.57,6.32 14.7,6.19 U$2.6
GND  (via drill 0.3)
  Top 0.127: C7.2 16.35,13.3 16.35,12.41 C6.2 16.35,12.29 16.35,11.14 C4.2 16.35,11.02 16.35,10 C5.2 16.35,9.87 18.64,7.59 J7.P$1 | 12.16,5.05 12.41,5.3 U3.4 | 12.16,5.05 11.52,4.41 11.27,4.41 C12.1 | 13.56,2.38 13.3,2.38 U3.6 13.18,2.38 U3.5 12.41,2.38 12.16,2.38 v11.91,2.63 | 13.56,2.38 13.81,2.38 U3.7 | 13.56,2.38 13.56,3.78 U3.9 13.43,3.78 12.16,5.05 | C3.2 2.89,9.87 3.27,9.87 3.9,10.51 C1.2 | U2.12 8.35,2.63 7.97,3.02 7.97,3.14 6.7,4.41 5.17,4.41 4.41,5.17 4.41,6.06 4.29,6.19 3.52,6.19 3.4,6.32 3.4,7.08 2.89,7.59 2.89,9.75 C3.2 | C9.2 11.27,16.1 11.27,15.21 C8.1 11.16,14.94 v10.76,14.53 | v6.57,6.57 7.59,5.56 7.59,5.3 U2.4 | C2.2 3.78,14.7 4.03,14.7 5.43,16.1 5.68,16.1 X1.3 5.81,16.22 6.7,15.33 7.08,15.33 X1.1 | U1.A25 7.08,12.41 7.33,12.67 U1.B26 7.46,12.67 8.22,12.67 8.35,12.79 | U1.G1 8.35,7.46 8.6,7.71 U1.H2 8.48,7.84 8.48,8.73 | 8.35,10.13 8.1,9.87 7.33,9.87 U1.B12 | U1.J31 8.73,13.81 8.73,13.18 8.48,12.92 U1.104 | 8.48,8.73 U1.48 | 8.48,8.73 U1.104 | U1.104 8.98,9.37 9.49,8.86 U1.44 9.62,8.86 10.64,8.86 U1.39 10.76,8.86 11.91,8.86 U1.35 | 8.35,10.13 U1.49 | 8.35,10.13 U1.104 | U1.45 9.62,10.13 U1.104 | U1.104 10.13,10.76 10.64,10.25 U1.40 10.76,10.13 11.91,10.13 U1.36 | U1.50 8.48,11.52 8.98,12.03 U1.104 | 8.35,12.79 U1.51 | 8.35,12.79 U1.104 | U1.46 9.62,11.52 U1.104 | U1.47 9.49,12.79 8.98,12.29 U1.104 | 10.76,11.52 11.91,11.52 U1.37 | U1.A25 6.32,12.41 5.81,12.92 4.67,12.92 4.29,13.3 4.29,14.06 3.78,14.57 C2.2 | U1.A25 | 10.76,11.52 U1.41 | 10.76,11.52 U1.104 | C3.2 2.76,9.87 2.76,10.13 2.38,10.51 2.38,13.3 3.65,14.57 C2.2 | C13.2 15.93,5.29 v15.82,5.4
  Bottom 0.127: J7.P$1 18.64,7.59 18.25,7.59 16.86,6.19 16.22,6.19 U$2.4 16.1,6.06 16.1,5.81 15.82,5.53 | 9.11,3.27 7.59,1.75 C10.2 | 11.91,3.27 10.64,3.27 10.25,2.89 9.49,2.89 9.11,3.27 | 11.91,3.27 13.05,3.27 S1.2 13.18,3.27 14.06,4.16 14.06,4.41 14.45,4.79 15.08,4.79 15.82,5.53 | 9.11,3.27 S1.3 | 11.91,3.27 v11.91,2.63 | U1.41 10.64,11.52 10.13,12.03 J1.P$1 | U1.43 10.76,12.79 10.76,12.29 J1.P$1 | 11.95,12.83 11.91,12.92 J1.P$1 | 11.95,12.83 U1.38 | C11.2 4.03,4.67 5.81,4.67 6.44,5.3 6.44,5.56 U4.2 6.57,5.68 v6.57,6.57 6.57,6.95 8.35,8.73 | 8.35,8.73 U1.48 | S1.5 10.59,5.98 8.84,5.98 8.35,6.47 8.35,8.73 | v10.76,14.53 10.76,14.01 11.95,12.83 | v15.82,5.4 15.82,5.53
  other vias: 2.89,15.77 1.31,8.45 2,5.91 2.66,7.49 1.52,7.08
  pour Top: -1.51,16.91 8.15,16.91 8.15,13.28 10.79,13.28 10.79,16.91 12.95,16.91 21.94,16.91 21.94,-1.1 -1.51,-1.1
  pour Bottom: -1.28,16.68 22.12,16.68 22.12,-0.34 -1.28,-0.34
INT
  Top 0.127: 4.41,7.21 4.41,10 4.54,10.13 4.54,10.89 4.67,11.02 5.3,11.02 5.43,10.89 6.95,10.89 U1.A17 | 4.41,7.21 3.9,6.7 R3.2 | 4.41,7.21 4.92,7.21 6.44,5.68 6.44,4.79 6.57,4.67 7.21,4.67 8.86,3.02 8.86,2.89 9.11,2.63 U2.13
N$4
  Top 0.127: U1.A21 6.95,11.65 5.68,11.65 5.17,12.16 L4.2
N$5
  Top 0.127: L1.2 3.65,13.56 3.65,12.29 L4.1
N$6
  Top 0.127: L2.2 3.78,9.49 3.78,8.35 3.65,8.22 L3.1
N$7
  Top 0.127: U1.B10 7.33,9.37 6.44,9.37 5.3,8.22 L3.2
N$8  (via drill 0.3)
  Top 0.127: v8.48,14.32 8.35,14.19 U1.G31 | C2.1 4.79,14.57 4.79,13.68 L1.1 4.92,13.56 v5.56,13.56 5.85,13.56 6.5,12.91 6.86,12.91 U1.A27
  Bottom 0.127: v5.56,13.56 6.32,14.32 v8.48,14.32
N$9
  Top 0.127: 5.05,10.51 6.95,10.51 U1.A15 | 5.05,10.51 5.05,9.62 L2.1 | 5.05,10.51 C1.1
N$10
  Top 0.127: U1.C31 7.59,13.81 7.59,14.83 7.71,14.95 7.71,15.71 7.21,16.22 X1.2
N$11
  Top 0.127: X1.4 5.81,15.21 5.81,14.32 6.71,13.42 U1.B30
N$12
  Top 0.127: 9.11,15.08 10.13,15.08 C8.2 | 9.11,15.08 L5.2 | U1.L31 9.15,14.06 arc-45 9.09,14.22 | 9.09,15.02 arc-45 9.11,15.08
  Top 0.508: 9.09,15.02 9.09,14.22
N$13  (1 unrouted)
  Top 0.127: 9.06,16.22 10.13,16.22 C9.1 | 9.06,18.3 X2.FP
  Top 0.635: 9.06,18.3 9.06,16.22
OS  (via drill 0.3)
  Top 0.127: v14.06,8.48 13.43,8.48 U1.AL5 | U3.3 13.3,5.43 12.79,5.94 11.91,5.94 10.51,4.54 v10.51,4.41 10.51,4.29 10.89,3.9 11.52,3.9 11.65,3.78 11.65,3.02 v11.27,2.63 | v9.37,1.75 7.59,1.75 7.21,2.13 7.21,3.02 6.95,3.27 5.94,3.27 3.9,5.3 3.9,5.68 R4.1
  Bottom 0.127: v14.06,8.48 14.06,4.79 13.81,4.54 13.81,4.29 13.68,4.16 10.76,4.16 v10.51,4.41 | v9.37,1.75 10.38,1.75 v11.27,2.63
RESET
  Top 0.127: J9.P$1 16.98,15.59 16.98,15.09 16.53,14.64 12.35,14.64 11.65,13.94 11.65,13.91 U1.AC31
SCL
  Top 0.127: R2.2 16.22,7.33 16.22,5.94 17.24,4.92 17.24,4.03 14.95,1.75 10,1.75 9.62,2.13 9.62,4.79 9.24,5.17 U2.2 9.11,5.3 10,6.19 11.98,6.19 | 11.98,6.19 13.18,6.19 13.56,5.81 13.56,5.68 13.81,5.43 U3.2 | 11.98,6.19 11.93,6.24 11.93,6.36 11.95,6.38 U1.AE1
SDA  (via drill 0.3)
  Top 0.127: U3.1 14.45,5.43 14.45,5.68 13.94,6.19 14.03,6.28 | 14.03,6.28 15.21,7.46 R1.1 | U2.3 8.48,5.3 8.86,5.68 8.86,5.81 9.48,6.43 v9.58,6.43 | U1.AJ1 12.75,7.19 v13.03,6.91 13.39,6.91 14.03,6.28
  Bottom 0.127: v9.58,6.43 11.68,6.43 11.88,6.23 12.64,6.23 12.89,6.48 12.89,6.77 v13.03,6.91
SW  (via drill 0.3)
  Top 0.127: v13.94,10.38 13.43,10.38 U1.AL15
  Bottom 0.127: v13.94,10.38 13.94,8.98 13.18,8.22 13.18,7.59 13.63,7.13 13.63,5.38 13.18,4.92 S1.1 13.05,4.92 9.11,4.92 S1.4
SWCLK
  Top 0.127: J10.P$1 14.97,17.64 14.97,16.75 14.88,16.66 13.56,16.66 10.85,13.94 10.85,13.91 U1.W31
SWDIO
  Top 0.127: J11.P$1 16.1,16.6 16.1,15.61 15.66,15.18 12.49,15.18 11.25,13.94 11.25,13.91 U1.AA31